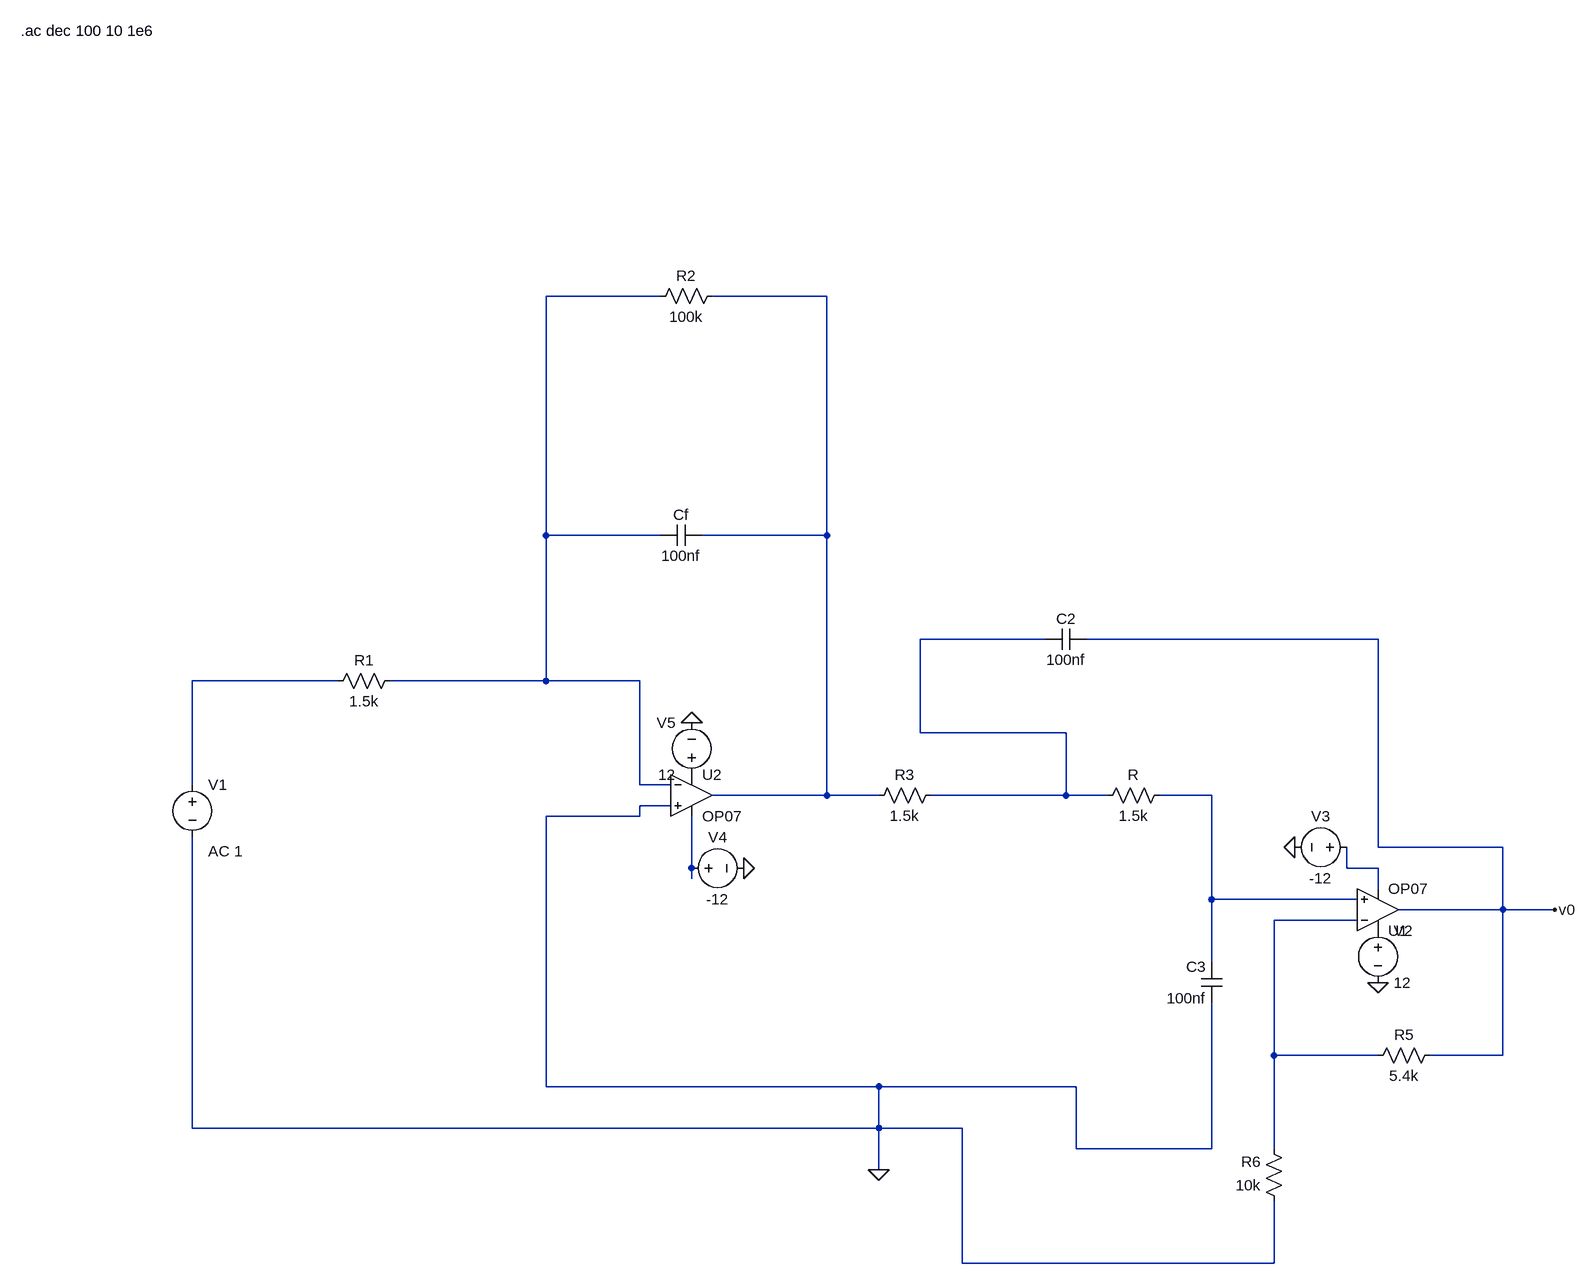
[diagram p0: schematic lt_spicesch.asc]
lt_spicesch.asc, the LTspice schematic file:
Version 4
SHEET 1 2088 804
WIRE 672 -688 496 -688
WIRE 928 -688 752 -688
WIRE 496 -320 496 -688
WIRE 672 -320 496 -320
WIRE 928 -320 928 -688
WIRE 928 -320 736 -320
WIRE 1264 -160 1072 -160
WIRE 1776 -160 1328 -160
WIRE 176 -96 -48 -96
WIRE 496 -96 496 -320
WIRE 496 -96 256 -96
WIRE 640 -96 496 -96
WIRE 1072 -16 1072 -160
WIRE 1296 -16 1072 -16
WIRE -48 64 -48 -96
WIRE 640 64 640 -96
WIRE 688 64 640 64
WIRE 928 80 928 -320
WIRE 928 80 752 80
WIRE 1008 80 928 80
WIRE 1296 80 1296 -16
WIRE 1296 80 1088 80
WIRE 1360 80 1296 80
WIRE 1520 80 1440 80
WIRE 688 96 640 96
WIRE 640 112 640 96
WIRE 640 112 496 112
WIRE 1776 160 1776 -160
WIRE 1968 160 1776 160
WIRE 720 192 720 112
WIRE 1728 192 1728 160
WIRE 1776 192 1728 192
WIRE 720 208 720 192
WIRE 1776 224 1776 192
WIRE 1520 240 1520 80
WIRE 1744 240 1520 240
WIRE 1968 256 1968 160
WIRE 1968 256 1808 256
WIRE 2048 256 1968 256
WIRE 1744 272 1616 272
WIRE 1520 336 1520 240
WIRE 1616 480 1616 272
WIRE 1776 480 1616 480
WIRE 1968 480 1968 256
WIRE 1968 480 1856 480
WIRE 496 528 496 112
WIRE 1008 528 496 528
WIRE 1312 528 1008 528
WIRE -48 592 -48 144
WIRE 1008 592 1008 528
WIRE 1008 592 -48 592
WIRE 1136 592 1008 592
WIRE 1312 624 1312 528
WIRE 1520 624 1520 400
WIRE 1520 624 1312 624
WIRE 1616 624 1616 480
WIRE 1008 656 1008 592
WIRE 1136 800 1136 592
WIRE 1616 800 1616 704
WIRE 1616 800 1136 800
FLAG 1008 656 0
FLAG 800 192 0
FLAG 720 -32 0
FLAG 1648 160 0
FLAG 1776 368 0
FLAG 2048 256 v0
SYMBOL Cap 736 -336 R90
WINDOW 0 0 32 VBottom 2
WINDOW 3 32 32 VTop 2
SYMATTR InstName Cf
SYMATTR Value 100nf
SYMBOL Cap 1328 -176 R90
WINDOW 0 0 32 VBottom 2
WINDOW 3 32 32 VTop 2
SYMATTR InstName C2
SYMATTR Value 100nf
SYMBOL Cap 1536 400 R180
WINDOW 0 24 56 Left 2
WINDOW 3 24 8 Left 2
SYMATTR InstName C3
SYMATTR Value 100nf
SYMBOL Res 272 -112 R90
WINDOW 0 0 56 VBottom 2
WINDOW 3 32 56 VTop 2
SYMATTR InstName R1
SYMATTR Value 1.5k
SYMBOL Res 768 -704 R90
WINDOW 0 0 56 VBottom 2
WINDOW 3 32 56 VTop 2
SYMATTR InstName R2
SYMATTR Value 100k
SYMBOL Res 1104 64 R90
WINDOW 0 0 56 VBottom 2
WINDOW 3 32 56 VTop 2
SYMATTR InstName R3
SYMATTR Value 1.5k
SYMBOL Res 1456 64 R90
WINDOW 0 0 56 VBottom 2
WINDOW 3 32 56 VTop 2
SYMATTR InstName R
SYMATTR Value 1.5k
SYMBOL Res 1872 464 R90
WINDOW 0 0 56 VBottom 2
WINDOW 3 32 56 VTop 2
SYMATTR InstName R5
SYMATTR Value 5.4k
SYMBOL Res 1632 720 R180
WINDOW 0 36 76 Left 2
WINDOW 3 36 40 Left 2
SYMATTR InstName R6
SYMATTR Value 10k
SYMBOL Voltage -48 48 R0
WINDOW 123 24 118 Left 2
SYMATTR Value2 AC 1
SYMATTR InstName V1
SYMATTR Value ""
SYMBOL OpAmps/OP07 1776 320 M180
SYMATTR InstName U1
SYMBOL OpAmps/OP07 720 16 R0
SYMATTR InstName U2
SYMBOL Voltage 1776 272 R0
SYMATTR InstName V2
SYMATTR Value 12
SYMBOL Voltage 1744 160 R90
WINDOW 0 -32 56 VBottom 2
WINDOW 3 32 56 VTop 2
SYMATTR InstName V3
SYMATTR Value -12
SYMBOL Voltage 704 192 R270
WINDOW 0 32 56 VTop 2
WINDOW 3 -32 56 VBottom 2
SYMATTR InstName V4
SYMATTR Value -12
SYMBOL Voltage 720 64 R180
WINDOW 0 24 96 Left 2
WINDOW 3 24 16 Left 2
SYMATTR InstName V5
SYMATTR Value 12
TEXT -312 -1096 Left 2 !.ac dec 100 10 1e6

The netlist it stands for:
* lt_spicesch.asc
Cf N002 N001 100nf
C2 v0 N003 100nf
C3 0 N005 100nf
R1 N001 N004 1.5k
R2 N002 N001 100k
R3 N003 N002 1.5k
R N005 N003 1.5k
R5 v0 N008 5.4k
R6 0 N008 10k
V1 N004 0 AC 1
XU1 N005 N008 P001 N007 v0 LT1001  ; OP07, pins In+ In- V+ V- OUT
XU2 0 N001 P002 N006 N002 LT1001  ; OP07, pins In+ In- V+ V- OUT
V2 P001 0 12
V3 N007 0 -12
V4 N006 0 -12
V5 P002 0 12
.ac dec 100 10 1e6
.lib LTC.lib
.backanno
.end